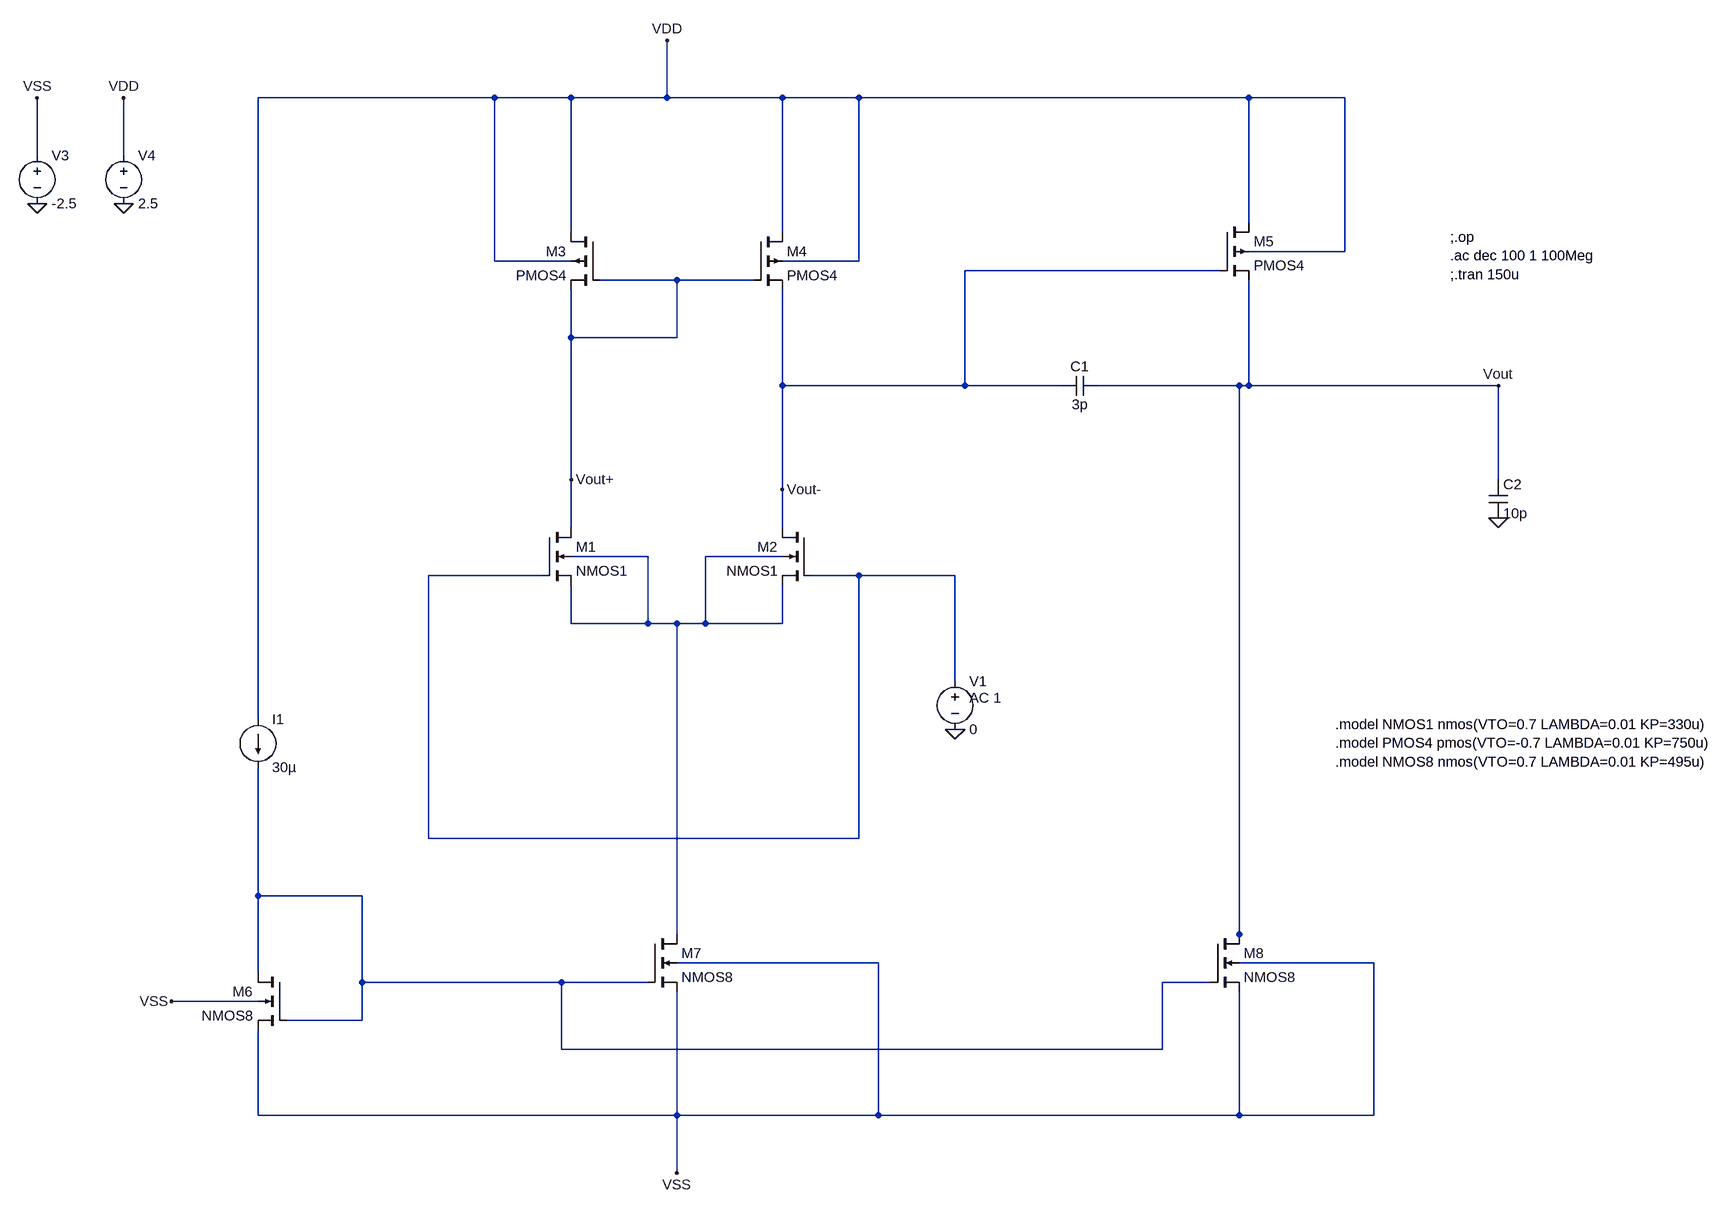
[diagram p0: schematic Two_Stage_CMOS_OpAmp.asc]
Two_Stage_CMOS_OpAmp.asc, the LTspice schematic file:
Version 4.1
SHEET 1 2324 680
WIRE 32 -2192 -1024 -2192
WIRE 160 -2192 32 -2192
WIRE 320 -2192 320 -2288
WIRE 320 -2192 160 -2192
WIRE 512 -2192 320 -2192
WIRE 640 -2192 512 -2192
WIRE 1488 -2192 640 -2192
WIRE 1648 -2192 1488 -2192
WIRE -1392 -2096 -1392 -2192
WIRE -1248 -2096 -1248 -2192
WIRE 1488 -1984 1488 -2192
WIRE 160 -1968 160 -2192
WIRE 512 -1968 512 -2192
WIRE 1648 -1936 1648 -2192
WIRE 1648 -1936 1488 -1936
WIRE 32 -1920 32 -2192
WIRE 160 -1920 32 -1920
WIRE 640 -1920 640 -2192
WIRE 640 -1920 512 -1920
WIRE 1440 -1904 816 -1904
WIRE 336 -1888 208 -1888
WIRE 464 -1888 336 -1888
WIRE 160 -1792 160 -1872
WIRE 336 -1792 336 -1888
WIRE 336 -1792 160 -1792
WIRE 512 -1712 512 -1872
WIRE 816 -1712 816 -1904
WIRE 816 -1712 512 -1712
WIRE 976 -1712 816 -1712
WIRE 1472 -1712 1040 -1712
WIRE 1488 -1712 1488 -1888
WIRE 1488 -1712 1472 -1712
WIRE 1904 -1712 1488 -1712
WIRE 160 -1552 160 -1792
WIRE 1904 -1552 1904 -1712
WIRE 512 -1536 512 -1712
WIRE 160 -1472 160 -1552
WIRE 512 -1472 512 -1536
WIRE 288 -1424 160 -1424
WIRE 512 -1424 384 -1424
WIRE 112 -1392 -128 -1392
WIRE 640 -1392 560 -1392
WIRE 800 -1392 640 -1392
WIRE 160 -1312 160 -1376
WIRE 288 -1312 288 -1424
WIRE 288 -1312 160 -1312
WIRE 336 -1312 288 -1312
WIRE 384 -1312 384 -1424
WIRE 384 -1312 336 -1312
WIRE 512 -1312 512 -1376
WIRE 512 -1312 384 -1312
WIRE 800 -1216 800 -1392
WIRE -1024 -1152 -1024 -2192
WIRE -128 -896 -128 -1392
WIRE 640 -896 640 -1392
WIRE 640 -896 -128 -896
WIRE -1024 -800 -1024 -1072
WIRE -832 -800 -1024 -800
WIRE 336 -736 336 -1312
WIRE 1472 -736 1472 -1712
WIRE 1472 -720 1472 -736
WIRE 672 -688 336 -688
WIRE 1696 -688 1472 -688
WIRE -1024 -672 -1024 -800
WIRE -832 -656 -832 -800
WIRE 144 -656 -832 -656
WIRE 288 -656 144 -656
WIRE 1424 -656 1344 -656
WIRE -1024 -624 -1168 -624
WIRE -832 -592 -832 -656
WIRE -832 -592 -976 -592
WIRE 144 -544 144 -656
WIRE 1344 -544 1344 -656
WIRE 1344 -544 144 -544
WIRE -1024 -384 -1024 -576
WIRE 336 -384 336 -640
WIRE 336 -384 -1024 -384
WIRE 672 -384 672 -688
WIRE 672 -384 336 -384
WIRE 1472 -384 1472 -640
WIRE 1472 -384 672 -384
WIRE 1696 -384 1696 -688
WIRE 1696 -384 1472 -384
WIRE 336 -288 336 -384
FLAG 1904 -1488 0
FLAG -1248 -2016 0
FLAG -1392 -2016 0
FLAG -1248 -2192 VDD
FLAG -1392 -2192 VSS
FLAG 320 -2288 VDD
FLAG 336 -288 VSS
FLAG 160 -1552 Vout+
FLAG 512 -1536 Vout-
FLAG 1904 -1712 Vout
FLAG 800 -1136 0
FLAG -1168 -624 VSS
SYMBOL nmos4 112 -1472 R0
SYMATTR InstName M1
SYMATTR Value NMOS1
SYMATTR Value2 l=1u w=3u
SYMBOL nmos4 560 -1472 M0
SYMATTR InstName M2
SYMATTR Value NMOS1
SYMATTR Value2 l=1u w=3u
SYMBOL pmos4 208 -1968 M0
SYMATTR InstName M3
SYMATTR Value PMOS4
SYMATTR Value2 l=1u w=15u
SYMBOL pmos4 464 -1968 R0
SYMATTR InstName M4
SYMATTR Value PMOS4
SYMATTR Value2 l=1u w=15u
SYMBOL pmos4 1440 -1984 R0
SYMATTR InstName M5
SYMATTR Value PMOS4
SYMATTR Value2 l=1u w=93.3u
SYMBOL cap 1040 -1728 R90
WINDOW 0 0 32 VBottom 2
WINDOW 3 32 32 VTop 2
SYMATTR InstName C1
SYMATTR Value 3p
SYMBOL nmos4 288 -736 R0
SYMATTR InstName M7
SYMATTR Value NMOS8
SYMATTR Value2 l=1u w=4.5u
SYMBOL nmos4 1424 -736 R0
SYMATTR InstName M8
SYMATTR Value NMOS8
SYMATTR Value2 l=1u w=14u
SYMBOL cap 1888 -1552 R0
SYMATTR InstName C2
SYMATTR Value 10p
SYMBOL voltage -1392 -2112 R0
WINDOW 123 24 44 Left 2
WINDOW 39 0 0 Left 0
SYMATTR InstName V3
SYMATTR Value -2.5
SYMBOL voltage -1248 -2112 R0
WINDOW 123 24 44 Left 2
WINDOW 39 0 0 Left 0
SYMATTR InstName V4
SYMATTR Value 2.5
SYMBOL voltage 800 -1232 R0
WINDOW 123 24 44 Left 2
WINDOW 39 0 0 Left 0
SYMATTR InstName V1
SYMATTR Value 0
SYMATTR Value2 AC 1
SYMBOL current -1024 -1152 R0
SYMATTR InstName I1
SYMATTR Value 30µ
SYMBOL nmos4 -976 -672 M0
SYMATTR InstName M6
SYMATTR Value NMOS8
SYMATTR Value2 l=1u w=4.5u
TEXT 1824 -1960 Left 2 !;.op\n.ac dec 100 1 100Meg\n;.tran 150u
TEXT 1632 -1144 Left 2 !.model NMOS1 nmos(VTO=0.7 LAMBDA=0.01 KP=330u)\n.model PMOS4 pmos(VTO=-0.7 LAMBDA=0.01 KP=750u)\n.model NMOS8 nmos(VTO=0.7 LAMBDA=0.01 KP=495u)

The netlist it stands for:
* Two_Stage_CMOS_OpAmp.asc
M1 Vout+ N002 N001 N001 NMOS1 l=1u w=3u
M2 Vout- N002 N001 N001 NMOS1 l=1u w=3u
M3 VDD Vout+ Vout+ VDD PMOS4 l=1u w=15u
M4 VDD Vout+ Vout- VDD PMOS4 l=1u w=15u
M5 VDD Vout- Vout VDD PMOS4 l=1u w=93.3u
C1 Vout Vout- 3p
M7 N001 N003 VSS VSS NMOS8 l=1u w=4.5u
M8 Vout N003 VSS VSS NMOS8 l=1u w=14u
C2 Vout 0 10p
V3 VSS 0 -2.5
V4 VDD 0 2.5
V1 N002 0 0 AC 1
I1 VDD N003 30µ
M6 N003 N003 VSS VSS NMOS8 l=1u w=4.5u
.model NMOS NMOS
.model PMOS PMOS
.lib standard.mos
;.op
.ac dec 100 1 100Meg
;.tran 150u
.model NMOS1 nmos(VTO=0.7 LAMBDA=0.01 KP=330u)
.model PMOS4 pmos(VTO=-0.7 LAMBDA=0.01 KP=750u)
.model NMOS8 nmos(VTO=0.7 LAMBDA=0.01 KP=495u)
.backanno
.end